# EAGLE design Teensy Reactor (EAGLE 6.6.0)
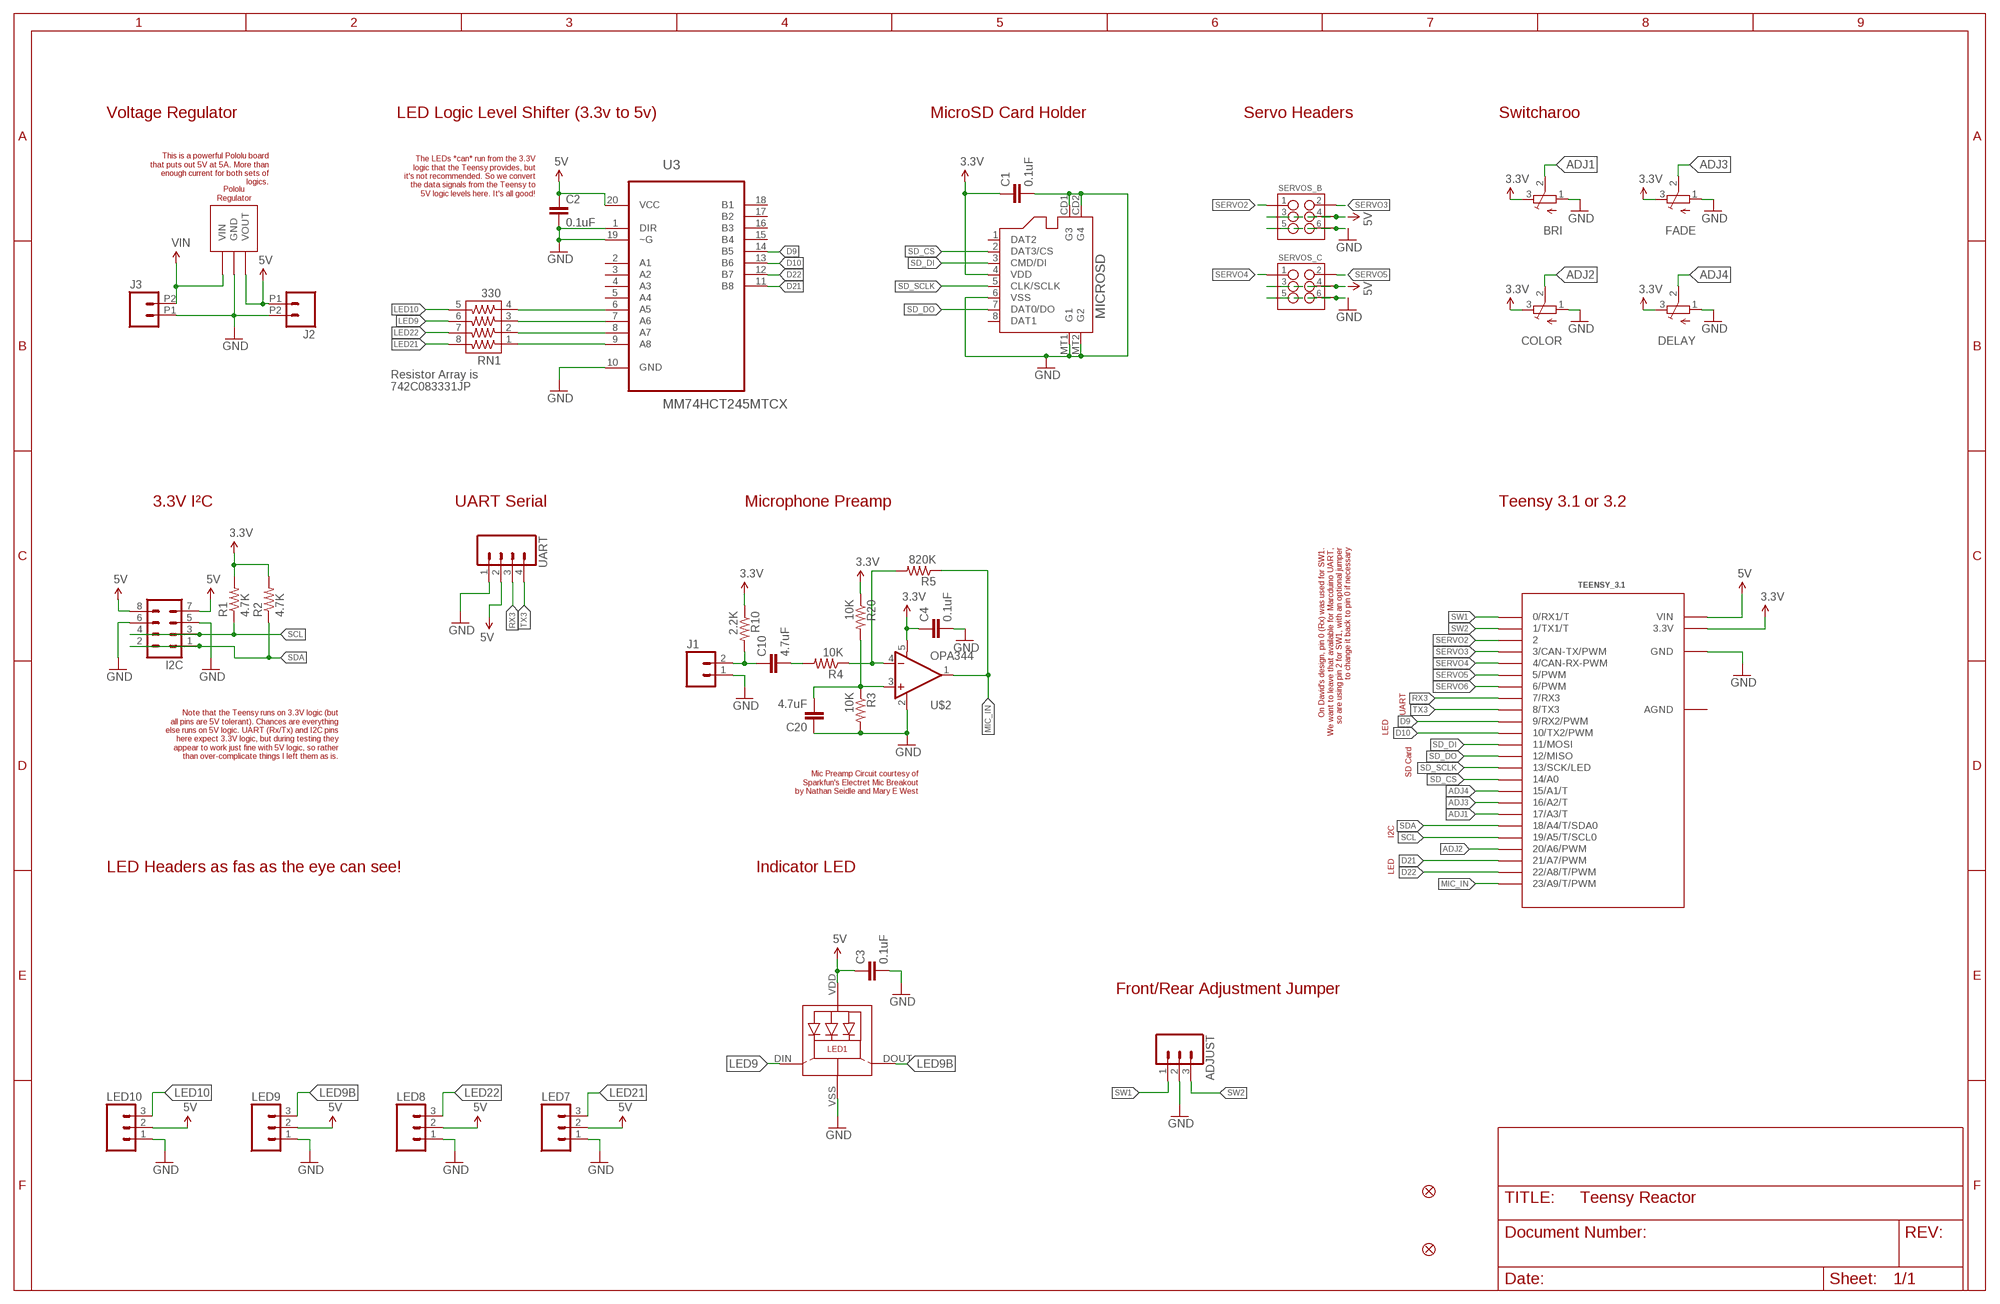
[diagram p0: schematic, sheet 1]

## Parts
ADJUST  M03PTH  [1X03]
BRI  TRIMPOTEVM3V  [EVM3V]
C1  0.1uF  2.2UF-10V-20%(0603)  [0603-CAP]
C2  0.1uF  2.2UF-10V-20%(0603)  [0603-CAP]
C3  0.1uF  2.2UF-10V-20%(0603)  [0603-CAP]
C4  0.1uF  2.2UF-10V-20%(0603)  [0603-CAP]
C10  4.7uF  2.2UF-10V-20%(0603)  [0603-CAP]
C20  4.7uF  2.2UF-10V-20%(0603)  [0603-CAP]
COLOR  TRIMPOTEVM3V  [EVM3V]
DELAY  TRIMPOTEVM3V  [EVM3V]
FADE  TRIMPOTEVM3V  [EVM3V]
FID1  FIDUCIAL1X2  [FIDUCIAL-1X2]
FID2  FIDUCIAL1X2  [FIDUCIAL-1X2]
I2C  M04X2  [2X4]
J1  M02PTH  [1X02]
J2  M022.54MM_SCREWTERM  [1X02_2.54_SCREWTERM]
J3  M022.54MM_SCREWTERM  [1X02_2.54_SCREWTERM]
LED1  WS2812BSK6812MINI  [SK6812MINI]
LED7  M03PTH  [1X03]
LED8  M03PTH  [1X03]
LED9  M03PTH  [1X03]
LED10  M03PTH  [1X03]
MICROSD  MICROSD  [MICROSD_SMALL]
R1  4.7K  RESISTOR0603-RES  [0603-RES]
R2  4.7K  RESISTOR0603-RES  [0603-RES]
R3  10K  RESISTOR0603-RES  [0603-RES]
R4  10K  RESISTOR0603-RES  [0603-RES]
R5  820K  RESISTOR0603-RES  [0603-RES]
R10  2.2K  RESISTOR0603-RES  [0603-RES]
R20  10K  RESISTOR0603-RES  [0603-RES]
RN1  330  742-8NS  [742-8NS]
SERVOS_B  M03X22X3_SILK_MALE_PTH  [2X3]
SERVOS_C  M03X22X3_SILK_MALE_PTH  [2X3]
TEENSY_3.1  TEENSY_3.1_SOME_PINS  [TEENSY3-SOME_PINS]
U3  MM74HCT245MTCX  [SOP65P640X120-20N]
U$1  POLOLU_REGD24V50FS_NO_HOLES  [D24V50F5_NO_HOLES]
U$2  OPA344  [SOT23-5]
UART  M04PTH  [1X04]

## Nets
3.3V: BRI.3(E) C1.1 C4.1 COLOR.3(E) DELAY.3(E) FADE.3(E) MICROSD.4(VDD) R1.2 R2.2 R10.1 R20.1 TEENSY_3.1.3.3V TEENSY_3.1.3.3V1(3.3V) U$2.5(V+)
5V: C2.1 C3.1 I2C.7 I2C.8 J2.P1 LED1.VDD LED7.2 LED8.2 LED9.2 LED10.2 SERVOS_B.3 SERVOS_B.4 SERVOS_C.3 SERVOS_C.4 TEENSY_3.1.VIN U3.20(VCC) U$1.VOUT UART.2
ADJ1: BRI.2(S) TEENSY_3.1.17/A3(17/A3/T)
ADJ2: COLOR.2(S) TEENSY_3.1.20/A6(20/A6/PWM)
ADJ3: FADE.2(S) TEENSY_3.1.16/A2(16/A2/T)
ADJ4: DELAY.2(S) TEENSY_3.1.15/A1(15/A1/T)
D9: TEENSY_3.1.9(9/RX2/PWM) U3.14(B5)
D10: TEENSY_3.1.10(10/TX2/PWM) U3.13(B6)
D21: TEENSY_3.1.21/A7(21/A7/PWM) U3.11(B8)
D22: TEENSY_3.1.22/A8(22/A8/T/PWM) U3.12(B7)
GND: ADJUST.2 BRI.1(A) C1.2 C2.2 C3.2 C4.2 C20.1 COLOR.1(A) DELAY.1(A) FADE.1(A) I2C.5 I2C.6 J1.1 J2.P2 J3.P1 LED1.VSS(GND) LED7.1 LED8.1 LED9.1 LED10.1 MICROSD.6(VSS) MICROSD.CD1(G3) MICROSD.CD2(G4) MICROSD.MT1(G1) MICROSD.MT2(G2) R3.2 SERVOS_B.5 SERVOS_B.6 SERVOS_C.5 SERVOS_C.6 TEENSY_3.1.GND TEENSY_3.1.GND1(GND) U3.1(DIR) U3.10(GND) U3.19(~G) U$1.GND1(GND) U$1.GND2(GND) U$2.2(V-) UART.1
LED9: LED1.DIN(DI) RN1.6
LED9B: LED1.DOUT(DO) LED9.3
LED10: LED10.3 RN1.5
LED21: LED7.3 RN1.8
LED22: LED8.3 RN1.7
MIC_IN: R5.1 TEENSY_3.1.23/A9(23/A9/T/PWM) U$2.1(OUT)
N$4: R4.1 R5.2 U$2.4(-IN)
N$5: C20.2 R3.1 R20.2 U$2.3(+IN)
N$8: C10.1 J1.2 R10.2
N$9: RN1.1 U3.9(A8)
N$10: RN1.2 U3.8(A7)
N$11: RN1.3 U3.7(A6)
N$12: RN1.4 U3.6(A5)
N$17: C10.2 R4.2
RX3: TEENSY_3.1.7(7/RX3) UART.3
SCL: I2C.3 I2C.4 R1.1 TEENSY_3.1.19/A5(19/A5/T/SCL0)
SD_CS: MICROSD.2(DAT3/CS) TEENSY_3.1.14/A0
SD_DI: MICROSD.3(CMD/DI) TEENSY_3.1.11(11/MOSI)
SD_DO: MICROSD.7(DAT0/DO) TEENSY_3.1.12(12/MISO)
SD_SCLK: MICROSD.5(CLK/SCLK) TEENSY_3.1.13(13/SCK/LED)
SDA: I2C.1 I2C.2 R2.1 TEENSY_3.1.18/A4(18/A4/T/SDA0)
SERVO2: SERVOS_B.1 TEENSY_3.1.2
SERVO3: SERVOS_B.2 TEENSY_3.1.3(3/CAN-TX/PWM)
SERVO4: SERVOS_C.1 TEENSY_3.1.4(4/CAN-RX-PWM)
SERVO5: SERVOS_C.2 TEENSY_3.1.5(5/PWM)
SERVO6: TEENSY_3.1.6(6/PWM)
SW1: ADJUST.1 TEENSY_3.1.0(0/RX1/T)
SW2: ADJUST.3 TEENSY_3.1.1(1/TX1/T)
TX3: TEENSY_3.1.8(8/TX3) UART.4
VIN: J3.P2 U$1.VIN
Unconnected: MICROSD.1(DAT2) MICROSD.8(DAT1) U3.2(A1) U3.3(A2) U3.4(A3) U3.5(A4) U3.15(B4) U3.16(B3) U3.17(B2) U3.18(B1)

## Notes on the sheet
- Voltage Regulator | LED Logic Level Shifter (3.3v to 5v) | MicroSD Card Holder | Servo Headers | Switcharoo
- This is a powerful Pololu board
  that puts out 5V at 5A. More than
  enough current for both sets of
  logics.
- The LEDs *can* run from the 3.3V
  logic that the Teensy provides, but
  it's not recommended. So we convert
  the data signals from the Teensy to
  5V logic levels here. It's all good!
- Resistor Array is
  742C083331JP
- 3.3V I²C | UART Serial | Microphone Preamp | Teensy 3.1 or 3.2
- On David's design, pin 0 (Rx) was used for SW1.
  We want to leave that available for Marcduino UART,
  so are using pin 2 for SW1, with an optional jumper
  to change it back to pin 0 if necessary
- UART
- LED
- Note that the Teensy runs on 3.3V logic (but
  all pins are 5V tolerant). Chances are everything
  else runs on 5V logic. UART (Rx/Tx) and I2C pins
  here expect 3.3V logic, but during testing they
  appear to work just fine with 5V logic, so rather
  than over-complicate things I left them as is.
- SD Card
- Mic Preamp Circuit courtesy of
  Sparkfun's Electret Mic Breakout
  by Nathan Seidle and Mary E West
- I2C
- LED Headers as fas as the eye can see! | Indicator LED
- LED
- Front/Rear Adjustment Jumper

## Power pins joined to a net without a drawn wire
AGND: TEENSY_3.1.AGND

## Library data of the parts
ADJUST LED7-LED10 = SparkFun-Connectors:M03: Header 3 Standard 3-pin 0.1" header. Use with straight break away headers (SKU : PRT-00116), right angle break away headers (PRT-00553), swiss pins (PRT-00743), machine pins (PRT-00117), and female headers (PRT-00115). Molex polarized connector foot print use with SKU : PRT-08232 with associated crimp pins and housings.
BRI COLOR DELAY FADE = rseries:TRIMPOT: Panasonic SMT trimmer potentiometer part number EVM3V http://industrial.panasonic.com/www-data/pdf/AOI0000/AOI0000CE4.pdf
C1-C4 C10 C20 = SparkFun-Capacitors:2.2UF-10V-20%(0603): CAP-07888; PROD_ID: CAP-07888; VALUE: 2.2uF
FID1 FID2 = SparkFun-Aesthetics:FIDUCIAL: Fiducial Alignment Points Various fiducial points for machine vision alignment.
I2C = SparkFun-Connectors:M04X2: .1" header, two rows of four.
J1-J3 = SparkFun-Connectors:M02: Standard 2-pin 0.1" header. Use with - straight break away headers ( PRT-00116) - right angle break away headers (PRT-00553) - swiss pins (PRT-00743) - machine pins (PRT-00117) - female headers (PRT-00115) Molex polarized connector foot print use with: PRT-08233 with associated crimp pins and housings. 2.54_SCREWTERM for use with PRT-10571. 3.5mm Screw Terminal footprints for PRT-08084 5mm Screw Terminal footprints for use with PRT-08432
LED1 = rseries:WS2812B: WS2812B is the 4-pin variant of the WS2812 http://www.mikrocontroller.net/attachment/180459/WS2812B_preliminary.pdf based on WS2812 from https://github.com/adafruit/Adafruit-Eagle-Library
MICROSD = rseries:MICROSD: Micro-SD / Transflash card holder with SPI pinout For the Molex 0473093751 small-footprint MicroSD holder.
R1-R5 R10 R20 = SparkFun-Passives:RESISTOR: Resistor Basic schematic elements and footprints for 0603, 1206, and PTH resistors.
RN1 = resistor-array:742-8: CTS 742 Series 8 Terminations, 4 Resistors
SERVOS_B SERVOS_C = SparkFun-Connectors:M03X2: 2x3 .1" header. Shrouded, with keying- CONN-10681 SMT- CONN-11415 Pogo pins- HW-11044; PROD_ID: CONN-09701
TEENSY_3.1 = rseries:TEENSY_3.1_SOME_PINS: Footprint for Teensy 3.1 or 3.2 board using almost all through-holes. VBat, Program, VUSB and AREF are left disconnected.
U3 = Fairchild_By_element14_Batch_1:MM74HCT245MTCX: Octal 3-STATE Transceiver; MPN: MM74HCT245MTCX; OC_FARNELL: 1607618; OC_NEWARK: 34C1266; PACKAGE: TSSOP-20; SUPPLIER: FAIRCHILD
U$1 = rseries:POLOLU_REG: D24V22F5 Regulator Module from Pololu (product ID D24V22F5). 6V-36V input , 5V 2.5A output https://www.pololu.com/product/2858
U$2 = SparkFun-AnalogIC:OPA344: Single gate rail-to-rail output op-amp. Inputs extend 300mV past rails.; PROD_ID: IC-08251
UART = SparkFun-Connectors:M04: Header 4 Standard 4-pin 0.1" header. Use with straight break away headers (SKU : PRT-00116), right angle break away headers (PRT-00553), swiss pins (PRT-00743), machine pins (PRT-00117), and female headers (PRT-00115). Molex polarized connector foot print use with SKU : PRT-08231 with associated crimp pins and housings. 1MM SMD Version SKU: PRT-10208; PROD_ID: CONN-09696

## Board
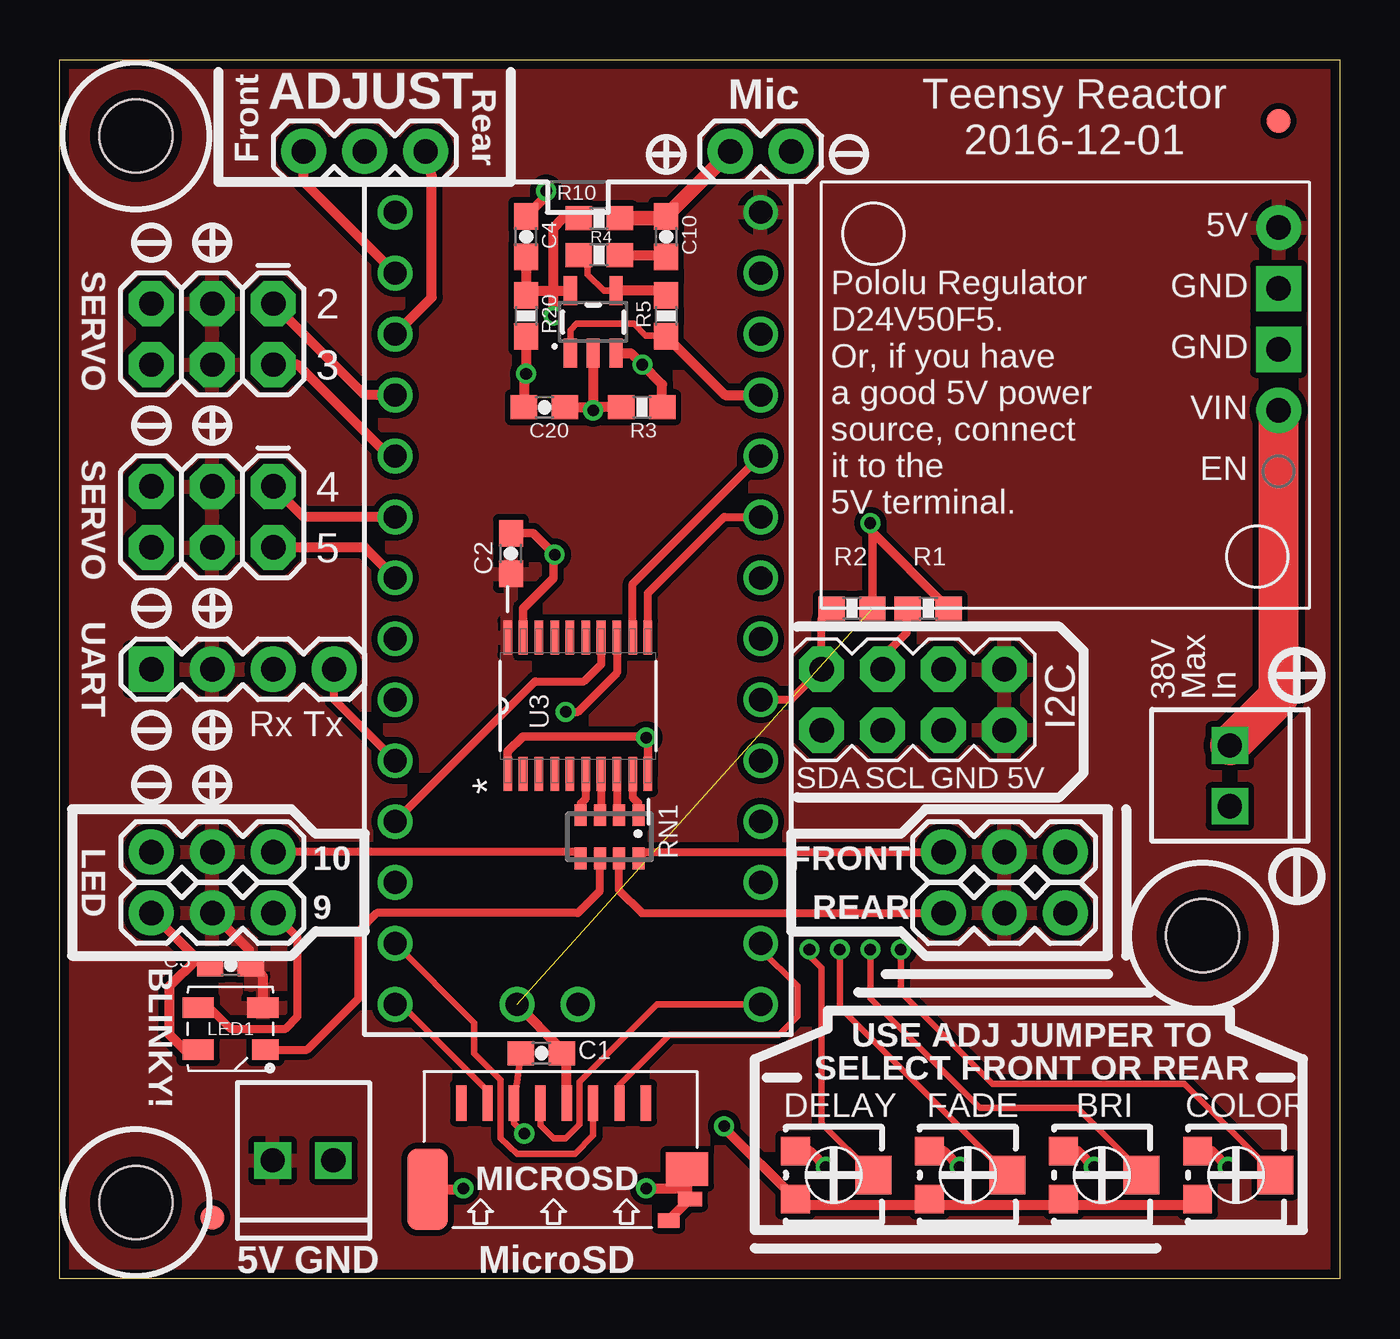
[diagram p1: board, top side]
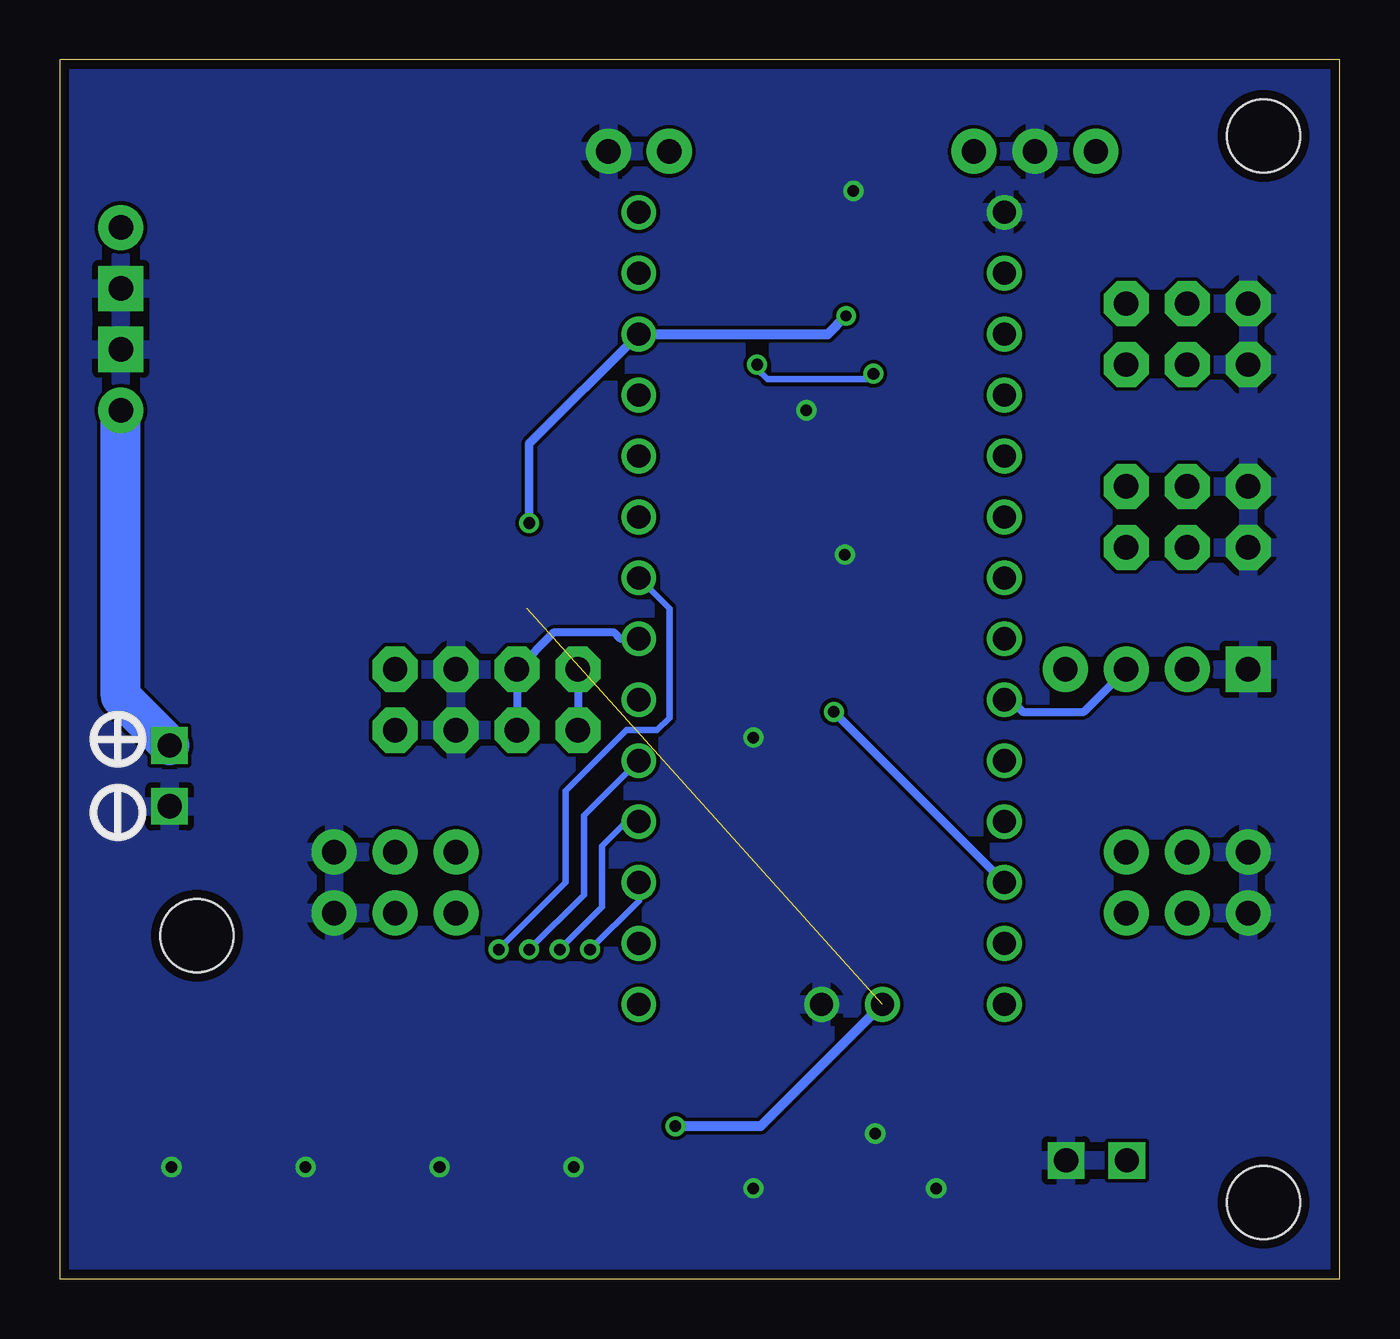
[diagram p2: board, bottom side, seen from below]

Size 53.34 x 50.8 mm. Coordinates in mm from the lower left corner, seen from the top.
Outline: 0,0 0,50.8 53.34,50.8 53.34,0 0,0
Copper layers (1*16): Top 0.0356mm / dielectric 1.5011mm / Bottom 0.0356mm
Design rules "LaenPCBOrder *": minimum track width 8mil, minimum drill 13mil, track to track 6mil, track to pad 6mil, pad to pad 6mil, via to via 6mil, smd to smd 6mil, copper to edge 15mil, drill to drill 6mil, minimum pad ring 7mil, minimum via ring 7mil, stop-mask expansion 3mil, vias tented up to drill 22mil, thermal gap 10mil
Holes 3.05 mm at 47.62,14.29 3.17,47.62 3.17,3.17

### Footprints (pad centres in the part's own frame; a part is rotated, then mirrored left to right if it is on the bottom)
1X03 = drill 1.016 pad 1.88: 1 0,0; 2 2.54,0; 3 5.08,0
EVM3V = smd 1.2 x 1.2: 1 -1,-1.6; 3 1,-1.6 | smd 1.6 x 1.5: 2 0,1.65
0603-CAP = smd 1.1 x 1: 1 -0.85,0; 2 0.85,0
FIDUCIAL-1X2 = smd 1 x 1: 1 0,0
2X4 = drill 1.016 pad 1.88 octagon: 1 -3.81,-1.27; 2 -3.81,1.27; 3 -1.27,-1.27; 4 -1.27,1.27; 5 1.27,-1.27; 6 1.27,1.27; 7 3.81,-1.27; 8 3.81,1.27
1X02 = drill 1.016 pad 1.88: 1 0,0; 2 2.54,0
1X02_2.54_SCREWTERM = drill 1.016 square: P1 2.54,0; P2 0,0
SK6812MINI = smd 1.1 x 0.85: DIN 1.45,-0.875 | smd 1.3 x 0.85: DOUT -1.35,0.875; VDD 1.35,0.875; VSS -1.35,-0.875
MICROSD_SMALL = smd 0.432 x 1.473: 1 3.85,-0.3; 2 2.75,-0.3; 3 1.65,-0.3; 4 0.55,-0.3; 5 -0.55,-0.3; 6 -1.65,-0.3; 7 -2.75,-0.3; 8 -3.85,-0.3 | smd 0.9 x 0.6: CD1 4.8,-5.2 | smd 1 x 0.6: CD2 5.7,-4.3 | smd 1.7 x 3.4: MT1 -5.25,-3.9 | smd 1.75 x 1.4: MT2 5.575,-3.05
0603-RES = smd 1.1 x 1: 1 -0.85,0; 2 0.85,0
742-8NS = smd 0.5 x 0.9: 1 -1.2,-0.9; 2 -0.4,-0.9; 3 0.4,-0.9; 4 1.2,-0.9; 5 1.2,0.9; 6 0.4,0.9; 7 -0.4,0.9; 8 -1.2,0.9
2X3 = drill 1.016 pad 1.88 octagon: 1 0,0; 2 0,2.54; 3 2.54,0; 4 2.54,2.54; 5 5.08,0; 6 5.08,2.54
TEENSY3-SOME_PINS = drill 0.965 pad 1.448: 0 -7.62,13.97; 1 -7.62,11.43; 2 -7.62,8.89; 3 -7.62,6.35; 3.3V 7.62,11.43; 3.3V1 -2.54,-16.51; 4 -7.62,3.81; 5 -7.62,1.27; 6 -7.62,-1.27; 7 -7.62,-3.81; 8 -7.62,-6.35; 9 -7.62,-8.89; 10 -7.62,-11.43; 11 -7.62,-13.97; 12 -7.62,-16.51; 13 7.62,-16.51; 14/A0 7.62,-13.97; 15/A1 7.62,-11.43; 16/A2 7.62,-8.89; 17/A3 7.62,-6.35; 18/A4 7.62,-3.81; 19/A5 7.62,-1.27; 20/A6 7.62,1.27; 21/A7 7.62,3.81; 22/A8 7.62,6.35; 23/A9 7.62,8.89; AGND 7.62,13.97; GND -7.62,16.51; GND1 0,-16.51; VIN 7.62,16.51
SOP65P640X120-20N = smd 1.422 x 0.356: 1 -2.845,2.921; 2 -2.845,2.286; 3 -2.845,1.626; 4 -2.845,0.965; 5 -2.845,0.33; 6 -2.845,-0.33; 7 -2.845,-0.965; 8 -2.845,-1.626; 9 -2.845,-2.286; 10 -2.845,-2.921; 11 2.845,-2.921; 12 2.845,-2.286; 13 2.845,-1.626; 14 2.845,-0.965; 15 2.845,-0.33; 16 2.845,0.33; 17 2.845,0.965; 18 2.845,1.626; 19 2.845,2.286; 20 2.845,2.921
D24V50F5_NO_HOLES = drill 1.016 pad 1.88 square: GND1 1.905,-8.89; GND2 4.445,-8.89 | drill 1.016 pad 1.88: VIN -0.635,-8.89; VOUT 6.985,-8.89
SOT23-5 = smd 0.55 x 1.2: 1 -0.95,-1.3; 2 0,-1.3; 3 0.95,-1.3; 4 0.95,1.3; 5 -0.95,1.3
1X04 = drill 1.016 pad 1.88 square: 1 0,0 | drill 1.016 pad 1.88: 2 2.54,0; 3 5.08,0; 4 7.62,0

### Placement (x,y rotation side)
ADJUST  10.16,46.99 0 top
BRI  43.43,4.32 270 top
C1  20.07,9.4 180 top
C2  18.8,30.23 90 top
C3  7.11,13.09 180 top
C4  19.43,43.43 90 top
C10  25.27,43.43 270 top
C20  20.19,36.32 180 top
COLOR  49.02,4.32 270 top
DELAY  32.26,4.32 270 top
FADE  37.85,4.32 270 top
FID1  6.35,2.54 0 top
FID2  50.8,48.26 0 top
I2C  35.56,24.13 0 top
J1  30.48,46.99 180 top
J2  11.4,4.93 180 top
J3  48.77,22.23 270 top
LED1  7.11,10.41 0 top
LED7  41.91,17.78 180 top
LED8  41.91,15.24 180 top
LED9  3.81,15.24 0 top
LED10  3.81,17.78 0 top
MICROSD  20.57,7.62 0 top
R1  36.2,27.94 0 top
R2  33.02,27.94 0 top
R3  24.26,36.32 180 top
R4  22.48,42.67 0 top
R5  25.27,40.13 90 top
R10  22.48,44.2 0 top
R20  19.43,40.13 270 top
RN1  22.91,18.41 180 top
SERVOS_B  8.89,40.64 180 top
SERVOS_C  8.89,33.02 180 top
TEENSY_3.1  21.59,27.94 0 top
U3  21.59,23.88 90 top
U$1  41.91,36.83 90 top
U$2  22.23,39.88 0 top
UART  3.81,25.4 0 top

### Tracks (layer width: path | path; a pad name or v marks a point on that pad's centre or on a via)
3.3V  (via drill 0.46, 0.48)  (1 unrouted)
  Top 0.279: R20.1 19.43,41.18 | 20.55,41.2 20.57,41.18
  Top 0.356: R2.2 33.87,31.41 v33.78,31.5 33.78,31.2 R1.2
  Top 0.406: MICROSD.4 21.12,9.19 C1.1 20.92,9.56 TEENSY_3.1.3.3V1 | COLOR.3 47.15,3.05 42.1,3.05 BRI.3 41.56,3.05 36.52,3.05 FADE.3 35.98,3.05 30.93,3.05 DELAY.3 27.69,6.29 v27.69,6.35 | C4.1 R20.1 | 19.43,41.18 20.57,41.18 | 20.57,41.18 U$2.5 | R10.1 20.98,44.2 20.55,43.76 20.55,41.2 | v20.57,40.13 20.57,41.18
  Bottom 0.356: TEENSY_3.1.3.3V 33.78,34.8 v33.78,31.5
  Bottom 0.406: TEENSY_3.1.3.3V1 24.13,6.35 v27.69,6.35 | TEENSY_3.1.3.3V 21.34,39.37 v20.57,40.13
5V
  Top 0.406: LED1.VDD 8.46,12.59 C3.1 7.87,13.18 7.87,13.72 LED9.2
  pour Top (isolate 0.254, rank 3): 104.14,-1.27 -2.54,-1.27 -2.54,71.63 104.14,71.63
ADJ1  (via drill 0.48)
  Top 0.279: BRI.2 45.08,4.45 42.42,7.11 38.35,7.11 33.78,11.68 v33.78,13.72
  Bottom 0.279: TEENSY_3.1.17/A3 31.5,19.3 31.5,16 v33.78,13.72
ADJ2  (via drill 0.48)
  Top 0.279: COLOR.2 46.86,8.13 38.86,8.13 35.05,11.94 v35.05,13.72
  Bottom 0.279: v35.05,13.72 32.26,16.51 32.26,20.32 29.72,22.86 28.45,22.86 27.94,23.37 27.94,27.94 TEENSY_3.1.20/A6
ADJ3  (via drill 0.48)
  Top 0.279: FADE.2 32.51,11.3 v32.51,13.72
  Bottom 0.279: TEENSY_3.1.16/A2 29.72,19.05 30.73,18.03 30.73,15.49 v32.51,13.72
ADJ4  (via drill 0.48)
  Top 0.279: DELAY.2 31.75,6.48 31.75,12.95 31.24,13.46 v31.24,13.72
  Bottom 0.279: v31.24,13.72 29.21,15.75 TEENSY_3.1.15/A1
D9
  Top 0.33: TEENSY_3.1.9 19.81,24.89 21.84,24.89 22.55,25.6 U3.14
D10  (via drill 0.48)
  Top 0.33: v21.08,23.62 21.59,23.62 23.22,25.25 U3.13
  Bottom 0.33: TEENSY_3.1.10 v21.08,23.62
D21
  Top 0.33: U3.11 24.51,28.57 27.69,31.75 TEENSY_3.1.21/A7
D22
  Top 0.33: U3.12 23.88,28.96 TEENSY_3.1.22/A8
GND  (via drill 0.48)
  Top 0.279: C1.2 MICROSD.6 18.92,6.48 v19.36,6.04 | 22.1,36.32 v22.23,36.2 22.35,36.32
  Top 0.356: U3.19 19.3,27.94 20.57,29.21 20.57,30.12 v20.62,30.18 19.72,31.08 C2.2 | U3.10 24.51,22.48 v24.43,22.55 24.38,22.61 19.3,22.61 18.67,21.97 U3.1
  Top 0.406: C3.2 5.96,13.09 5.71,13.34 | 5.71,13.34 LED9.1 | LED1.VSS 5.19,9.54 4.57,10.16 4.57,12.19 5.71,13.34 | DELAY.1 31.26,5.32 v31.93,4.65 | FADE.1 36.85,5.32 v37.52,4.65 | BRI.1 42.43,5.32 v43.1,4.65 | COLOR.1 48.02,5.32 v48.69,4.65 | MICROSD.MT1 16.78,3.72 v16.82,3.76 | MICROSD.CD1 MICROSD.CD2 | MICROSD.MT2 26.15,3.44 MICROSD.CD2 | v24.43,3.76 25.84,3.76 MICROSD.CD2 | U$2.2 v22.23,36.2 | C20.1 22.1,36.32 | R3.2 22.35,36.32 | C4.2 20.27,45.12 v20.27,45.34
  pour Bottom (isolate 0.152): -6.35,-3.81 -6.35,73.66 105.41,73.66 105.41,-3.81
LED9
  Top 0.33: LED1.DIN 10.3,9.54 12.45,11.68 12.45,14.48 13.21,15.24 21.59,15.24 22.51,16.16 RN1.6
LED9B
  Top 0.33: LED1.DOUT 6.24,11.29 7.11,10.41 9.4,10.41 9.91,10.92 9.91,14.22 LED9.3
LED10
  Top 0.33: LED10.3 21.71,17.78 RN1.5
LED21
  Top 0.33: LED7.3 24.38,17.78 RN1.8
  Top 0.356: RN1.8
LED22
  Top 0.33: LED8.3 24.26,15.24 23.31,16.19 RN1.7
MIC_IN
  Top 0.279: U$2.1 21.27,39.54 21.54,39.8 23.93,39.8 24.41,39.32 25.24,39.32 R5.1
  Top 0.406: R5.1 27.73,36.83 TEENSY_3.1.23/A9
N$4
  Top 0.279: R5.2 25.27,41.18 | U$2.4 22.68,41.18 22,41.86 22,42.3 R4.1
  Top 0.406: 25.27,41.18 U$2.4
N$5  (via drill 0.48)
  Top 0.279: v19.43,37.72 19.34,37.63
  Top 0.406: U$2.3 23.8,38.58 v24.28,38.1 25.11,37.27 R3.1 | 19.34,37.63 C20.2 | R20.2 v19.43,37.72
  Bottom 0.279: v24.28,38.1 24.28,37.92 23.85,37.49 19.66,37.49 v19.43,37.72
N$8
  Top 0.279: 25.18,44.2 C10.1
  Top 0.406: 27.94,46.95 J1.2
  Top 0.61: R10.2 25.18,44.2 | C10.1 27.94,46.95
N$9
  Top 0.33: U3.9 23.88,20.07 24.11,19.84 24.11,19.32 RN1.1
N$10
  Top 0.33: U3.8 23.22,19.41 RN1.2
N$11
  Top 0.33: U3.7 22.55,19.36 RN1.3
N$12
  Top 0.33: RN1.4 21.72,19.32 21.72,19.81 21.92,20.02 U3.6
N$17
  Top 0.279: 25.18,42.67 C10.2
  Top 0.406: R4.2 25.18,42.67
RX3
  Bottom 0.33: TEENSY_3.1.7 13.72,24.13 13.21,23.62 10.67,23.62 UART.3
SCL
  Top 0.33: I2C.4 34.29,25.91 35.31,26.92 35.31,27.9 R1.1
  Bottom 0.33: TEENSY_3.1.19/A5 29.97,26.67 30.23,26.92 32.77,26.92 I2C.4 I2C.3
SD_CS
  Top 0.279: MICROSD.2 23.32,8.08 25.4,10.16 29.97,10.16 30.73,10.92 30.73,12.19 29.21,13.72 TEENSY_3.1.14/A0
SD_DI
  Top 0.279: MICROSD.3 22.22,5.97 21.46,5.21 19.05,5.21 18.38,5.84 18.38,8.29 17.27,9.4 17.27,10.67 TEENSY_3.1.11
SD_DO
  Top 0.279: MICROSD.7 17.82,7.83 14.48,11.18 TEENSY_3.1.12
SD_SCLK
  Top 0.279: MICROSD.5 20.02,6.39 20.57,5.84 21.08,5.84 21.67,6.43 21.67,8.2 24.89,11.43 TEENSY_3.1.13
SDA
  Top 0.33: TEENSY_3.1.18/A4 30.48,24.13 I2C.2 31.75,27.52 R2.1
  Bottom 0.33: I2C.2 I2C.1
SERVO2
  Top 0.406: TEENSY_3.1.2 12.7,36.83 SERVOS_B.1
SERVO3
  Top 0.406: TEENSY_3.1.3 13.72,34.29 9.91,38.1 SERVOS_B.2
SERVO4
  Top 0.406: TEENSY_3.1.4 10.16,31.75 SERVOS_C.1
SERVO5
  Top 0.406: TEENSY_3.1.5 12.7,30.48 SERVOS_C.2
SW1
  Top 0.406: TEENSY_3.1.0 10.16,45.72 ADJUST.1
SW2
  Top 0.406: TEENSY_3.1.1 15.49,40.89 15.49,45.97 ADJUST.3
TX3
  Top 0.33: TEENSY_3.1.8 11.43,24.13 UART.4
VIN
  Top 1.676: J3.P2 50.8,24.26 U$1.VIN
  Bottom 1.676: J3.P2 50.8,24.26 50.8,36.07

### Text on the board
tPlace: Mic | Front | Rear | Teensy Reactor / 2016-12-01 | SERVO | Pololu Regulator / D24V50F5. / Or, if you have / a good 5V power / source, connect / it to the / 5V terminal. | SERVO | 38V / Max / In | Rx Tx | SDA | SCL | GND | 5V | LED | 10 / 9 | FRONT / REAR | USE ADJ JUMPER TO / SELECT FRONT OR REAR | BLINKY! | 5V GND | MicroSD
tNames: 2 / 3 | 4 / 5
tDocu: 0 G 1 | 23 G | G / 0 / 1 / 2 / 3 / 4 / 5 / 6 / 7 / 8 / 9 / 10 / 11 / 12 | VIN / AG / 3.3v / 23 / 22 / 21 / 20 / 19 / 18 / 17 / 16 / 15 / 14 / 13 | 15 16 17 20